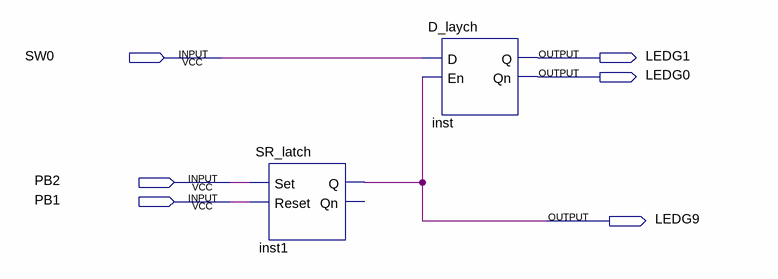
[diagram p0: schematic sheet]
// Quartus schematic L0704.bdf as structural Verilog: 2 symbols, 6 pins
module L0704 (
  input  SW0,
  input  PB2,
  input  PB1,
  output LEDG1,
  output LEDG0,
  output LEDG9
);

  SR_latch inst1 (.Set(PB2), .Reset(PB1), .Q(LEDG9));  // open: Qn
  D_laych inst (.D(SW0), .En(LEDG9), .Q(LEDG1), .Qn(LEDG0));
endmodule
